# EAGLE design mapleSDuino-V0.1_016-eagle7 (EAGLE 7.6.0)
MAPLE-CUx Large Version
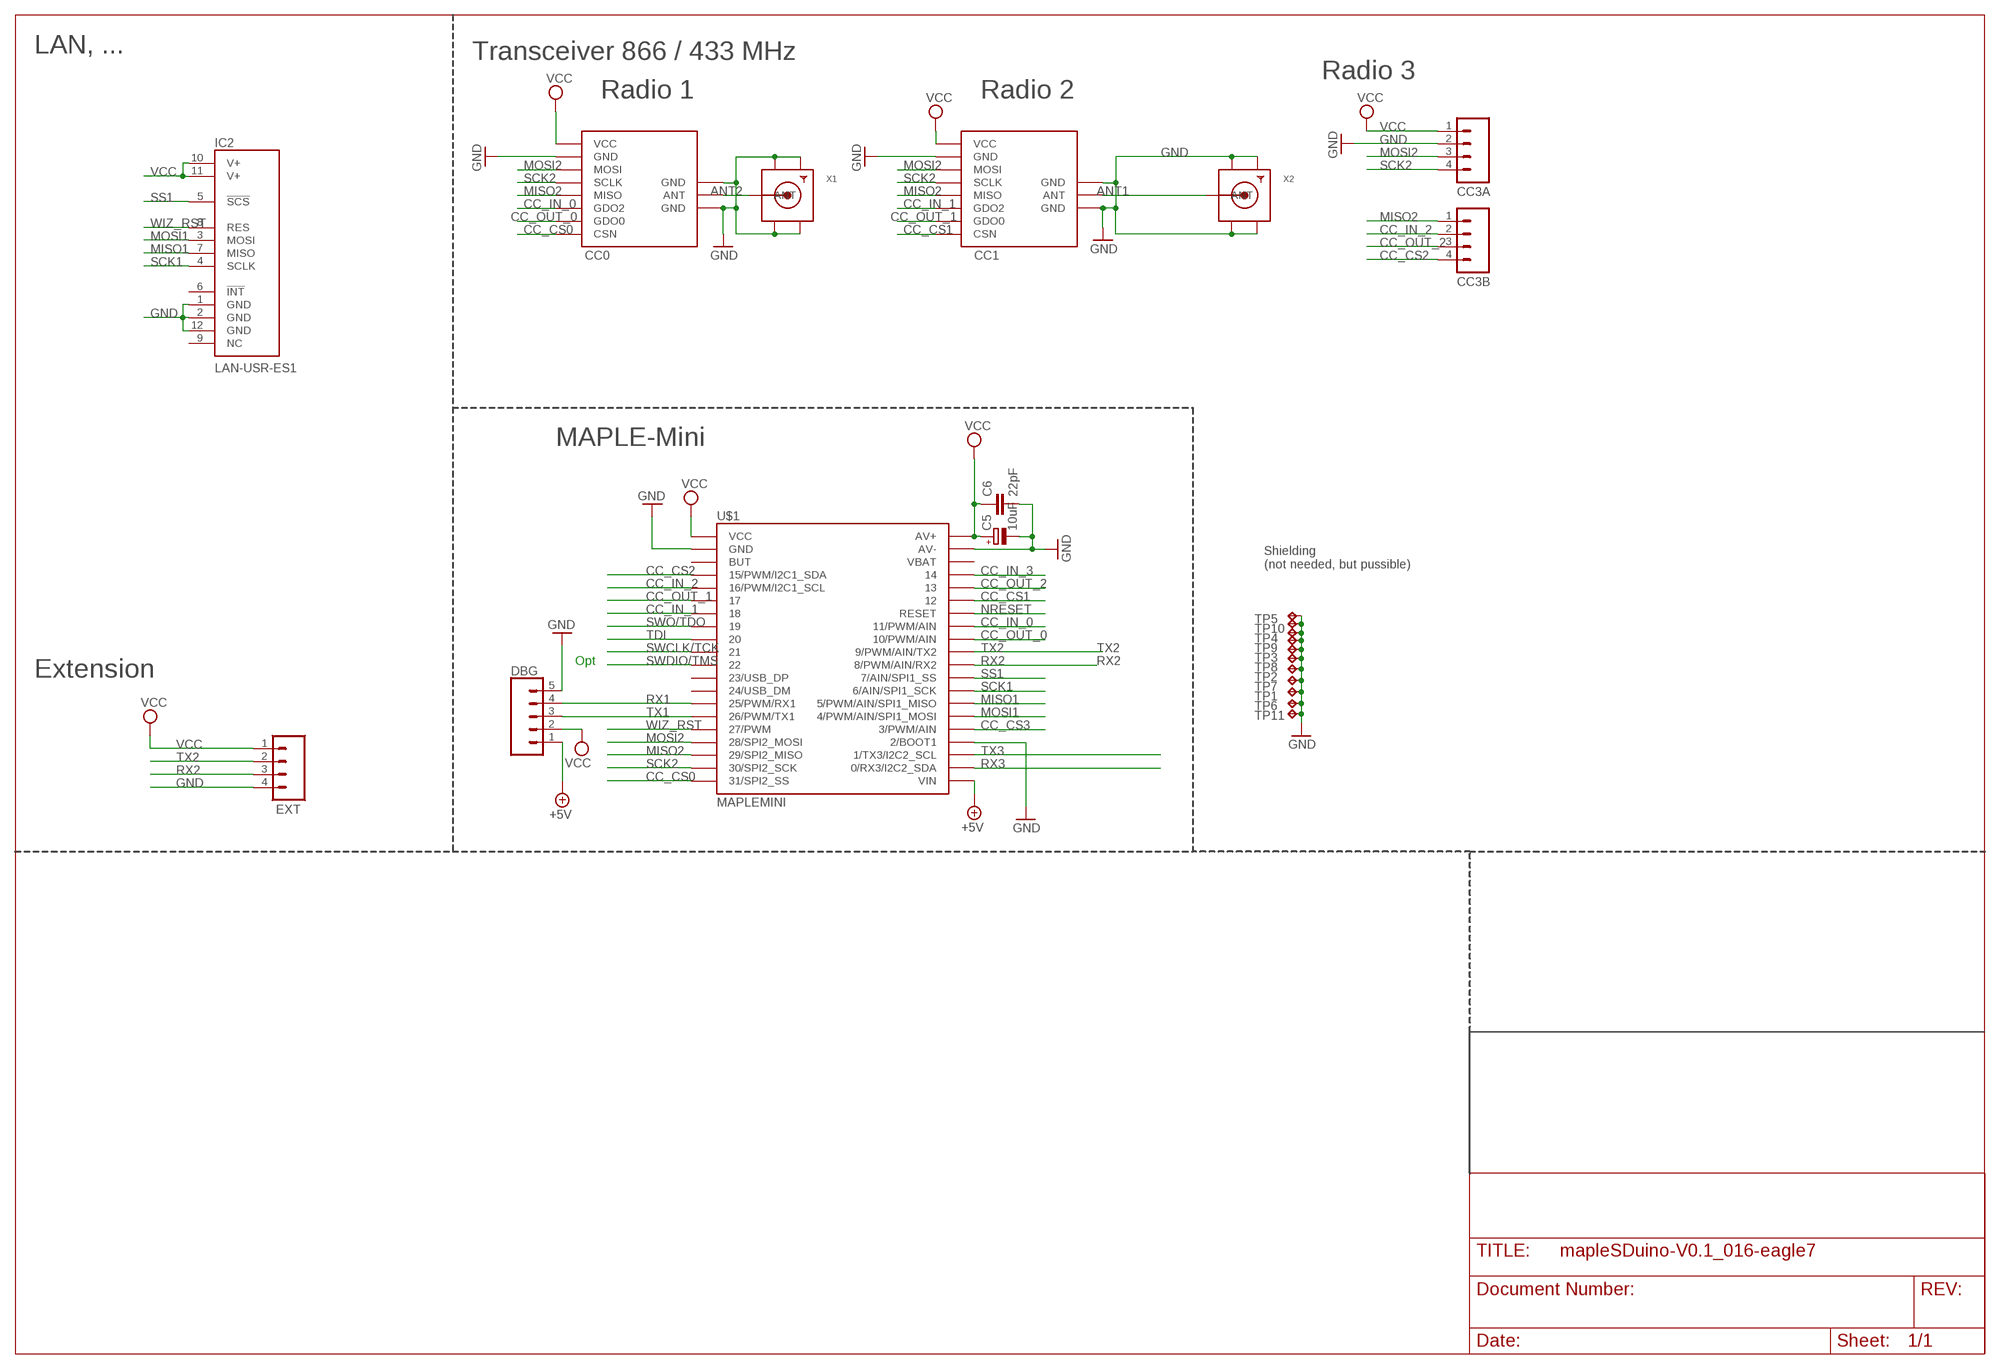
[diagram p0: schematic, sheet 1]

## Parts
C5  10uF  CPOL-EUR/2012-12W  [R/2012-12W]
C6  22pF  C-EUC0805  [C0805]
CC0  CC1101  CC1101_MODULE1SMD  [CC1101_MODULE1_SMD]
CC1  CC1101_MODULE1SMD  [CC1101_MODULE1_SMD]
CC3A  CONN_04PTH  [1X04]
CC3B  CONN_04PTH  [1X04]
DBG  CONN_05LOCK  [1X05_LOCK]
EXT  CONN_04PTH  [1X04]
IC2  LAN-USR-ES1  [USR-ES1]
TP1  TPTP06SQ  [TP06SQ]
TP2  TPTP06SQ  [TP06SQ]
TP3  TPTP06SQ  [TP06SQ]
TP4  TPTP06SQ  [TP06SQ]
TP5  TPTP06SQ  [TP06SQ]
TP6  TPTP06SQ  [TP06SQ]
TP7  TPTP06SQ  [TP06SQ]
TP8  TPTP06SQ  [TP06SQ]
TP9  TPTP06SQ  [TP06SQ]
TP10  TPTP06SQ  [TP06SQ]
TP11  TPTP06SQ  [TP06SQ]
U$1  MAPLEMINI  [20-DIP]
X1  SMACONNECTOR_EDGE  [SMA_EDGELAUNCH]
X2  SMACONNECTOR_EDGE  [SMA_EDGELAUNCH]

## Nets
+5V [PWR]: DBG.1 U$1.21(VIN)
ANT1 [PWR]: CC1.ANT X2.P(ANT)
ANT2: CC0.ANT X1.P(ANT)
CC_CS0: CC0.CSN U$1.20(31/SPI2_SS)
CC_CS1: CC1.CSN U$1.35
CC_CS2: CC3B.4 U$1.4(15/PWM/I2C1_SDA)
CC_CS3: U$1.25(3/PWM/AIN)
CC_IN_0: CC0.GDO2 U$1.33(11/PWM/AIN)
CC_IN_1: CC1.GDO2 U$1.7
CC_IN_2: CC3B.2 U$1.5(16/PWM/I2C1_SCL)
CC_IN_3: U$1.37
CC_OUT_0: CC0.GDO0 U$1.32(10/PWM/AIN)
CC_OUT_1: CC1.GDO0 U$1.6
CC_OUT_2: CC3B.3 U$1.36
GND [PWR]: C5.- C6.2 CC0.GND@0(GND) CC0.GND@1(GND) CC0.GND@2(GND) CC1.GND@0(GND) CC1.GND@1(GND) CC1.GND@2(GND) CC3A.2 DBG.5 EXT.4 IC2.1(GND) IC2.2(GND) IC2.12(GND) TP1.TP TP2.TP TP3.TP TP4.TP TP5.TP TP6.TP TP7.TP TP8.TP TP9.TP TP10.TP TP11.TP U$1.2(GND) U$1.24(2/BOOT1) U$1.39(AV-) X1.GND@1(GND4) X1.GND@2(GND3) X1.GND@3(GND2) X1.GND@4(GND1) X2.GND@1(GND4) X2.GND@2(GND3) X2.GND@3(GND2) X2.GND@4(GND1)
MISO1: IC2.7(MISO) U$1.27(5/PWM/AIN/SPI1_MISO)
MISO2: CC0.MISO CC1.MISO CC3B.1 U$1.18(29/SPI2_MISO)
MOSI1: IC2.3(MOSI) U$1.26(4/PWM/AIN/SPI1_MOSI)
MOSI2: CC0.MOSI CC1.MOSI CC3A.3 U$1.17(28/SPI2_MOSI)
NRESET: U$1.34(RESET)
RX1: DBG.4 U$1.14(25/PWM/RX1)
RX2: EXT.3 U$1.30(8/PWM/AIN/RX2)
RX3: U$1.22(0/RX3/I2C2_SDA)
SCK1: IC2.4(SCLK) U$1.28(6/AIN/SPI1_SCK)
SCK2: CC0.SCLK CC1.SCLK CC3A.4 U$1.19(30/SPI2_SCK)
SS1: IC2.5(!SCS!) U$1.29(7/AIN/SPI1_SS)
SWCLK/TCK: U$1.10
SWDIO/TMS: U$1.11
SWO/TDO: U$1.8
TDI: U$1.9
TX1: DBG.3 U$1.15(26/PWM/TX1)
TX2: EXT.2 U$1.31(9/PWM/AIN/TX2)
TX3: U$1.23(1/TX3/I2C2_SCL)
VCC [PWR]: C5.+ C6.1 CC0.VCC CC1.VCC CC3A.1 DBG.2 EXT.1 IC2.10(V+) IC2.11(V+) U$1.1(VCC) U$1.40(AV+)
WIZ_RST: IC2.8(RES) U$1.16(27/PWM)
Unconnected: IC2.6(!INT!) IC2.9(NC) U$1.3(BUT) U$1.12(23/USB_DP) U$1.13(24/USB_DM) U$1.38(VBAT)

## Notes on the sheet
- LAN, ... | Transceiver 866 / 433 MHz
- Radio 3
- Radio 1 | Radio 2
- MAPLE-Mini
- Shielding
  (not needed, but pussible)
- Opt
- Extension

## Library data of the parts
C5 = rcl:CPOL-EU: POLARIZED CAPACITOR, European symbol
C6 = rcl:C-EU: CAPACITOR, European symbol
CC0 CC1 = wireless:CC1101_MODULE1: CC1101 wireless module for 433/868 MHz (sold from Aliexpress). DIL version for mounting with pin header (and SMD soldering) and SMD only variant available.
CC3A CC3B EXT = SparkFun-Connectors:CONN_04: Multi connection point. Often used as Generic Header-pin footprint for 0.1 inch spaced/style header connections On any of the 0.1 inch spaced packages, you can populate with these: Break Away Headers - Straight <https://www.sparkfun.com/products/116> (PRT-00116) Break Away Male Headers - Right Angle <https://www.sparkfun.com/products/553> (PRT-00553) Female Headers <https://www.sparkfun.com/products/115> (PRT-00115) Break Away Headers - Machine Pin <https://www.sparkfun.com/products/117> (PRT-00117) Break Away Female Headers - Swiss Machine Pin <https://www.sparkfun.com/products/743> (PRT-00743) For SCREWTERMINALS and SPRING TERMINALS visit here: Screw Terimnals on SparkFun.com <https://www.sparkfun.com/search/results?term=Screw+Terminals> (5mm/3.5mm/2.54mm spacing) This device is also useful as a general connection point to wire up your design to another part of your project. Our various solder wires solder well into these plated through hole pads. Hook-Up Wire - Assortment (Stranded, 22 AWG) <https://www.sparkfun.com/products/11375> (PRT-11375) Hook-Up Wire - Assortment (Solid Core, 22 AWG) <https://www.sparkfun.com/products/11367> (PRT-11367) View the entire wire category on our website here <https://www.sparkfun.com/categories/141> Special notes: Molex polarized connector foot print use with SKU : PRT-08231 with associated crimp pins and housings. 1MM SMD Version SKU: PRT-10208; PROD_ID: CONN-09696
DBG = SparkFun-Connectors:CONN_05: Multi connection point. Often used as Generic Header-pin footprint for 0.1 inch spaced/style header connections On any of the 0.1 inch spaced packages, you can populate with these: Break Away Headers - Straight <https://www.sparkfun.com/products/116> (PRT-00116) Break Away Male Headers - Right Angle <https://www.sparkfun.com/products/553> (PRT-00553) Female Headers <https://www.sparkfun.com/products/115> (PRT-00115) Break Away Headers - Machine Pin <https://www.sparkfun.com/products/117> (PRT-00117) Break Away Female Headers - Swiss Machine Pin <https://www.sparkfun.com/products/743> (PRT-00743) For SCREWTERMINALS and SPRING TERMINALS visit here: Screw Terimnals on SparkFun.com <https://www.sparkfun.com/search/results?term=Screw+Terminals> (5mm/3.5mm/2.54mm spacing) This device is also useful as a general connection point to wire up your design to another part of your project. Our various solder wires solder well into these plated through hole pads. Hook-Up Wire - Assortment (Stranded, 22 AWG) <https://www.sparkfun.com/products/11375> (PRT-11375) Hook-Up Wire - Assortment (Solid Core, 22 AWG) <https://www.sparkfun.com/products/11367> (PRT-11367) View the entire wire category on our website here <https://www.sparkfun.com/categories/141> Special notes: Molex polarized connector foot print use with SKU : PRT-08231 with associated crimp pins and housings. 1MM SMD Version SKU: PRT-10208
IC2 = Martin-Communication:LAN-USR-ES1
TP1-TP11 = testpad:TP: Test pad
U$1 = maplemini-small:MAPLEMINI
X1 X2 = adafruit:SMACONNECTOR: SMA Connector 90° DIP SMA Connector, 50 Ohm (4UConnector: 07259)

## Net classes
0 default: width 0.305 mm
1 PWR: width 0.406 mm

## Board
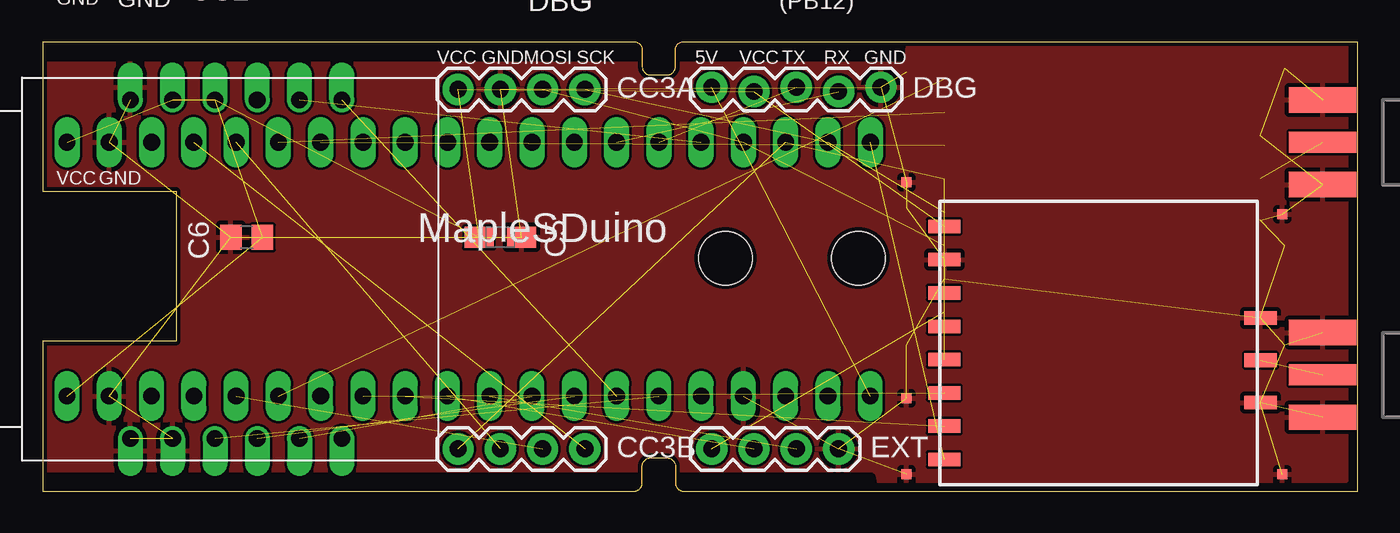
[diagram p1: board, top side]
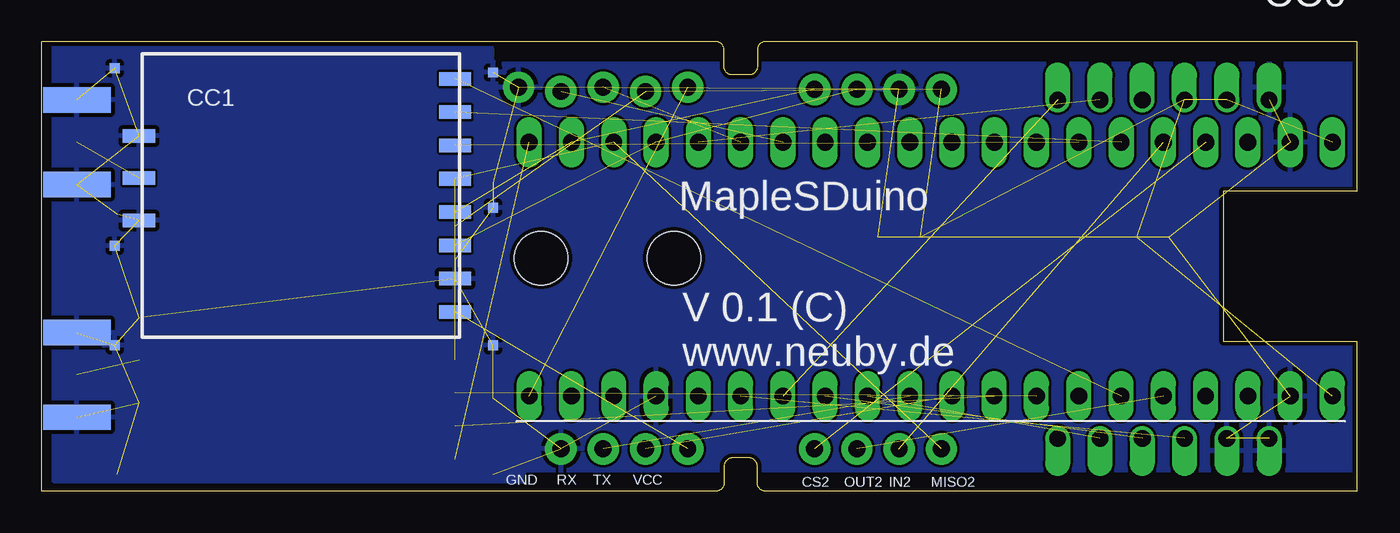
[diagram p2: board, bottom side, seen from below]

Size 79 x 27 mm. Coordinates in mm from the lower left corner, seen from the top.
Outline: 0,0 35.5,0 arc90 36,0.5 36,1.5 arc-90 36.5,2 37.5,2 arc-90 38,1.5 38,0.5 arc90 38.5,0 79,0 79,27 38.5,27 arc90 38,26.5 38,25.5 arc-90 37.5,25 36.5,25 arc-90 36,25.5 36,26.5 arc90 35.5,27 0,27 0,18 8,18 8,9 0,9 0,0
Copper layers (1*16): Top 0.035mm / dielectric 1.5mm / Bottom 0.035mm
Design rules "Fusion_eagle_rule_v1.1": minimum track width 6mil, minimum drill 12mil, track to track 6mil, track to pad 6mil, pad to pad 6mil, via to via 6mil, smd to smd 0mil, copper to edge 10mil, drill to drill 10mil, minimum pad ring 10mil, minimum via ring 6mil, stop-mask expansion 2mil, vias tented up to drill 100mil, thermal gap 10mil
Holes 3.2 mm at 49,14 41,14
tRestrict: 8 lines
bRestrict: 8 lines

### Footprints (pad centres in the part's own frame; a part is rotated, then mirrored left to right if it is on the bottom)
R/2012-12W = smd 1.75 x 1.26: + 1.275,0; - -1.275,0
C0805 = smd 1.3 x 1.5: 1 -0.95,0; 2 0.95,0
CC1101_MODULE1_SMD = smd 1.93 x 0.813: ANT 19,5.96; CSN 0,0; GDO0 0,2; GDO2 0,4; GND@0 0,12; GND@1 19,8.5; GND@2 19,3.42; MISO 0,6; MOSI 0,10; SCLK 0,8; VCC 0,14
1X04 = drill 1.016 pad 1.88: 1 0,0; 2 2.54,0; 3 5.08,0; 4 7.62,0
1X05_LOCK = drill 1.016 pad 1.88: 1 0,0.127; 2 2.54,-0.127; 3 5.08,0.127; 4 7.62,-0.127; 5 10.16,0.127
USR-ES1 = drill 1 pad 1.35 offset: 1 -10.16,5.715; 2 -10.16,3.175; 3 -10.16,0.635; 4 -10.16,-1.905; 5 -10.16,-4.445; 6 -10.16,-6.985; 7 10.16,-6.985; 8 10.16,-4.445; 9 10.16,-1.905; 10 10.16,0.635; 11 10.16,3.175; 12 10.16,5.715
TP06SQ = smd 0.6 x 0.6: TP 0,0
20-DIP = drill 1.016 pad 1.27 long: 1 -24.13,-7.62; 2 -21.59,-7.62; 3 -19.05,-7.62; 4 -16.51,-7.62; 5 -13.97,-7.62; 6 -11.43,-7.62; 7 -8.89,-7.62; 8 -6.35,-7.62; 9 -3.81,-7.62; 10 -1.27,-7.62; 11 1.27,-7.62; 12 3.81,-7.62; 13 6.35,-7.62; 14 8.89,-7.62; 15 11.43,-7.62; 16 13.97,-7.62; 17 16.51,-7.62; 18 19.05,-7.62; 19 21.59,-7.62; 20 24.13,-7.62 | drill 1 pad 1.27 long: 21 24.13,7.62; 22 21.59,7.62; 23 19.05,7.62; 24 16.51,7.62; 25 13.97,7.62; 26 11.43,7.62; 27 8.89,7.62; 28 6.35,7.62; 29 3.81,7.62; 30 1.27,7.62; 31 -1.27,7.62; 32 -3.81,7.62; 33 -6.35,7.62; 34 -8.89,7.62; 35 -11.43,7.62; 36 -13.97,7.62; 37 -16.51,7.62; 38 -19.05,7.62; 39 -21.59,7.62; 40 -24.13,7.62
SMA_EDGELAUNCH = smd 4.064 x 1.524: GND@1 2.032,-2.54; GND@2 2.032,2.54 | smd 4.064 x 1.524 bottom: GND@3 2.032,2.54; GND@4 2.032,-2.54 | smd 4.064 x 1.27: P 2.032,0

### Placement (x,y rotation side)
C5  27.48,15.24 180 top
C6  12.24,15.24 180 top
CC0  54.15,1.91 0 top
CC1  54.15,24.77 180 bottom
CC3A  24.94,24.13 0 top
CC3B  24.94,2.54 0 top
DBG  40.18,24.13 0 top
EXT  40.18,2.54 0 top
IC2  10.97,13.34 90 top
TP1  51.86,1.02 0 top
TP2  51.86,5.59 0 top
TP3  51.86,18.54 90 top
TP4  74.47,1.02 90 top
TP5  74.47,16.64 90 top
TP6  51.86,25.15 90 bottom
TP7  74.6,25.4 90 bottom
TP8  74.6,8.76 90 bottom
TP9  51.86,8.76 90 bottom
TP10  74.6,14.73 90 bottom
TP11  51.86,17.02 90 bottom
U$1  25.57,13.34 180 bottom
X1  78.92,6.99 180 top
X2  78.92,20.95 180 top

### Tracks (layer width: path | path; a pad name or v marks a point on that pad's centre or on a via)
+5V  (1 unrouted)
ANT1  (1 unrouted)
ANT2  (1 unrouted)
CC_CS0  (1 unrouted)
CC_CS1  (1 unrouted)
CC_CS2  (1 unrouted)
CC_IN_0  (1 unrouted)
CC_IN_1  (1 unrouted)
CC_IN_2  (1 unrouted)
CC_OUT_0  (1 unrouted)
CC_OUT_1  (1 unrouted)
CC_OUT_2  (1 unrouted)
GND  (35 unrouted)
  pour Top: 0.17,26.67 78.28,26.67 78.28,0.64 0.17,0.64
  pour Bottom: 0.17,26.67 78.28,26.67 78.28,0.64 0.17,0.64
MISO1  (1 unrouted)
MISO2  (3 unrouted)
MOSI1  (1 unrouted)
MOSI2  (3 unrouted)
RX1  (1 unrouted)
RX2  (1 unrouted)
SCK1  (1 unrouted)
SCK2  (3 unrouted)
SS1  (1 unrouted)
TX1  (1 unrouted)
TX2  (1 unrouted)
VCC  (10 unrouted)
WIZ_RST  (1 unrouted)

### Text on the board
tNames: GND | EXT | 31 / (PB12) | CC2 | TX | RX | GND | GND | CC2 | DBG | VCC | GND | MOSI | SCK | 5V | VCC | TX | RX | GND | VCC | GND | MapleSDuino
bNames: + | GND | CC0 | CC1 | MapleSDuino | V 0.1 (C) / www.neuby.de | MISO2 | IN2 | OUT2 | CS2 | VCC | TX | RX | GND
tValues: 10uF